# EAGLE design UselessBox (EAGLE 7.2.0)
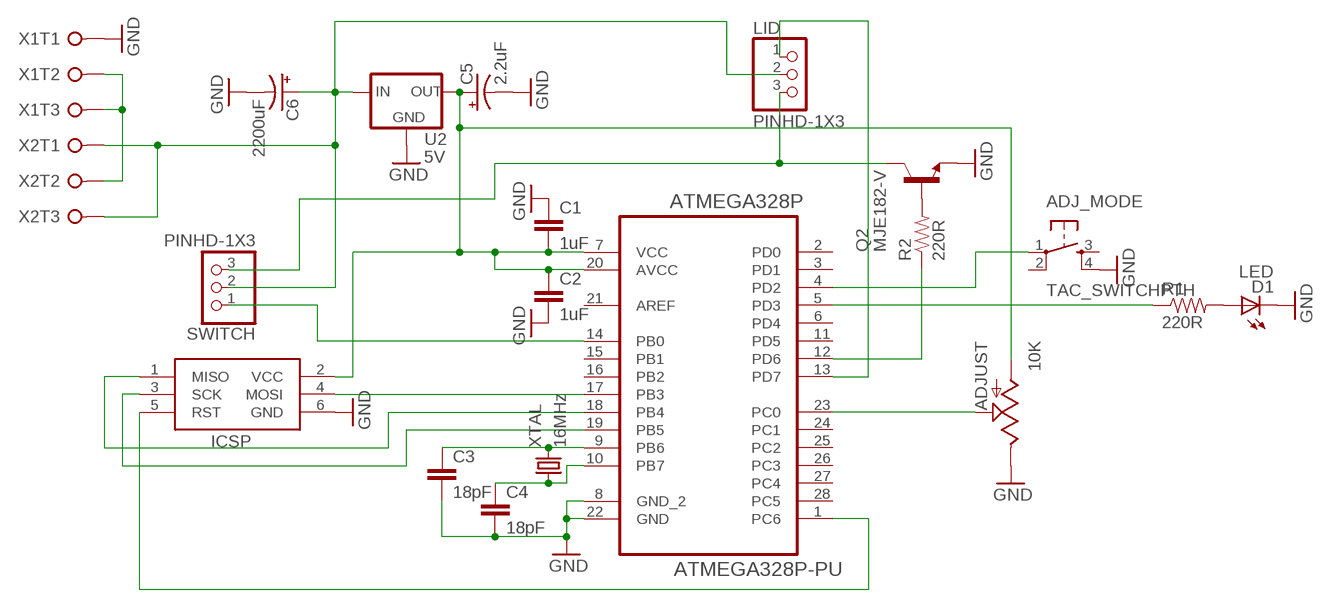
[diagram p0: schematic, sheet 1]

## Parts
ADJ_MODE  TAC_SWITCHPTH  [TACTILE-SWITCH-6MM]
ADJUST  10K  POT100K_3362U  [POT-3362U]
ATMEGA328P  ATMEGA328P-PU  [DIP28]
C1  1uF  CAPACITOR-5MM  [CAPACITOR-5MM]
C2  1uF  CAPACITOR-5MM  [CAPACITOR-5MM]
C3  18pF  CAPACITOR-2.5MM  [CAPACITOR-2.5MM]
C4  18pF  CAPACITOR-2.5MM  [CAPACITOR-2.5MM]
C5  2.2uF  CAP-POL-2.5-5  [CAP-POL-2.5-5]
C6  2200uF  CAP-POL-5-10  [CAP-POL-5-10]
D1  LED  [LED5MM]
ICSP  AVRISP-6  [AVRISP]
LID  PINHD-1X3  [1X03]
Q2  MJE182-V  [TO225AA-V]
R1  220R  RESISTOR-7.5MM  [AXIAL-7.5MM]
R2  220R  RESISTOR-7.5MM  [AXIAL-7.5MM]
SWITCH  PINHD-1X3  [1X03]
U2  5V  LP2950  [TO92-INLINE]
X1  SCREW-TERM-3  [SCREW-TERM-3]
X2  SCREW-TERM-3  [SCREW-TERM-3]
XTAL  16MHz  CRYSTAL-V  [CRYSTAL-V]

## Nets
GND: ADJ_MODE.4 ADJUST.P$1(E) ATMEGA328P.8(GND_2) ATMEGA328P.22(GND) C1.1 C2.2 C3.2 C4.2 C5.- C6.- D1.K(C) ICSP.6(GND) Q2.E U2.2(GND) X1.1
N$1: ATMEGA328P.13(PD7) LID.1
N$2: ADJ_MODE.1 ATMEGA328P.4(PD2)
N$3: ATMEGA328P.19(PB5) ICSP.3(SCK)
N$5: ATMEGA328P.18(PB4) ICSP.1(MISO)
N$6: ATMEGA328P.17(PB3) ICSP.4(MOSI)
N$7: ATMEGA328P.1(PC6) ICSP.5(RST)
N$8: ATMEGA328P.14(PB0) SWITCH.1
N$9: ATMEGA328P.9(PB6) C3.1 XTAL.2
N$10: ATMEGA328P.10(PB7) C4.1 XTAL.1
N$12: ATMEGA328P.12(PD6) R2.P$1
N$13: LID.3 Q2.C SWITCH.3
N$14: X1.2 X1.3 X2.2
N$15: ADJUST.P$2(S) ATMEGA328P.23(PC0)
N$17: Q2.B R2.P$2
N$18: D1.A R1.P$2
N$19: ATMEGA328P.5(PD3) R1.P$1
VCC: ADJUST.P$3(A) ATMEGA328P.7(VCC) ATMEGA328P.20(AVCC) C1.2 C2.1 C5.+ ICSP.2(VCC) U2.1(OUT)
VIN: C6.+ LID.2 SWITCH.2 U2.3(IN) X2.1 X2.3
Unconnected: ADJ_MODE.2 ADJ_MODE.3 ATMEGA328P.2(PD0) ATMEGA328P.3(PD1) ATMEGA328P.6(PD4) ATMEGA328P.11(PD5) ATMEGA328P.15(PB1) ATMEGA328P.16(PB2) ATMEGA328P.21(AREF) ATMEGA328P.24(PC1) ATMEGA328P.25(PC2) ATMEGA328P.26(PC3) ATMEGA328P.27(PC4) ATMEGA328P.28(PC5)

## Library data of the parts
ADJ_MODE = SaintGimp:TAC_SWITCH: Momentary Switch Button commonly used for reset or general input. Spark Fun Electronics SKU : COM-00097 SMT- SWCH-08247
ADJUST = SaintGimp:POT
ATMEGA328P = SaintGimp:ATMEGA328P-PU: 8-bit Microcontroller with In-System Programmable Flash; MPN: ATMEGA328P-PU; OC_FARNELL: 1715487; OC_NEWARK: 15R0268; PACKAGE: PDIP-28; SUPPLIER: Atmel
C1-C4 = SaintGimp:CAPACITOR-*: Ceramic Capacitor
C5 C6 = SaintGimp:CAP-POL: Polarized Capacitor
D1 = SaintGimp:LED
ICSP = SaintGimp:AVRISP: AVR ISP HEADER Standard 6 pin header for AVR programming
LID SWITCH = SaintGimp:PINHD-1X3: PIN HEADER
Q2 = SaintGimp:MJE182: NPN Transistor
R1 R2 = SaintGimp:RESISTOR-*
U2 = SaintGimp:LP2950: Volate Regulator
X1 X2 = SaintGimp:SCREW-TERM-3: 3-Pin Screw Terminal
XTAL = SaintGimp:CRYSTAL: Crystal Oscillator

## Board
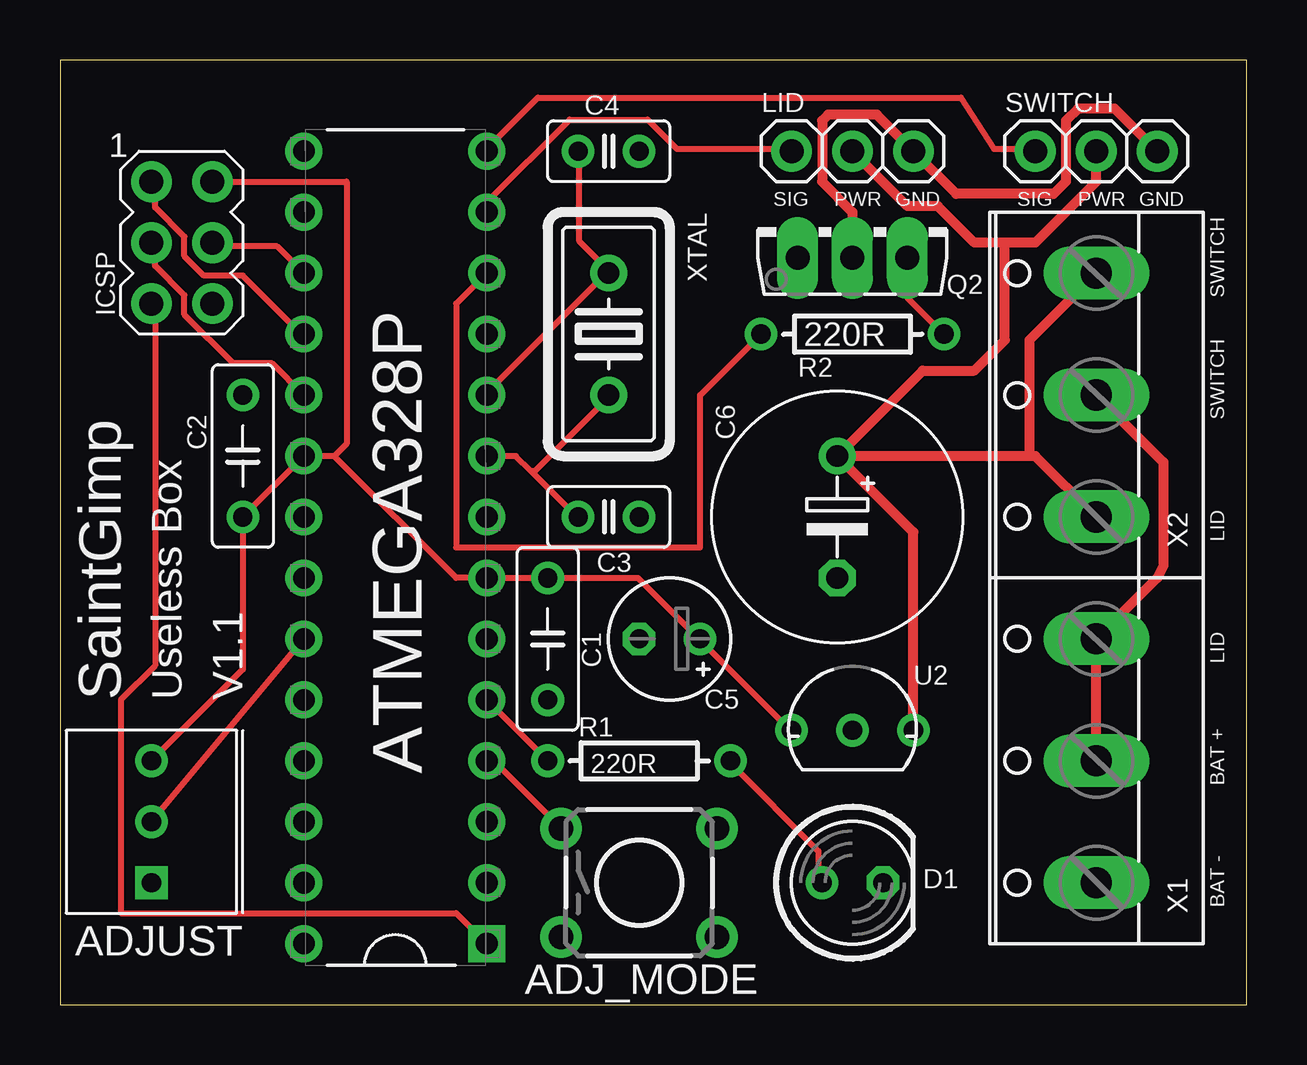
[diagram p1: board, top side]
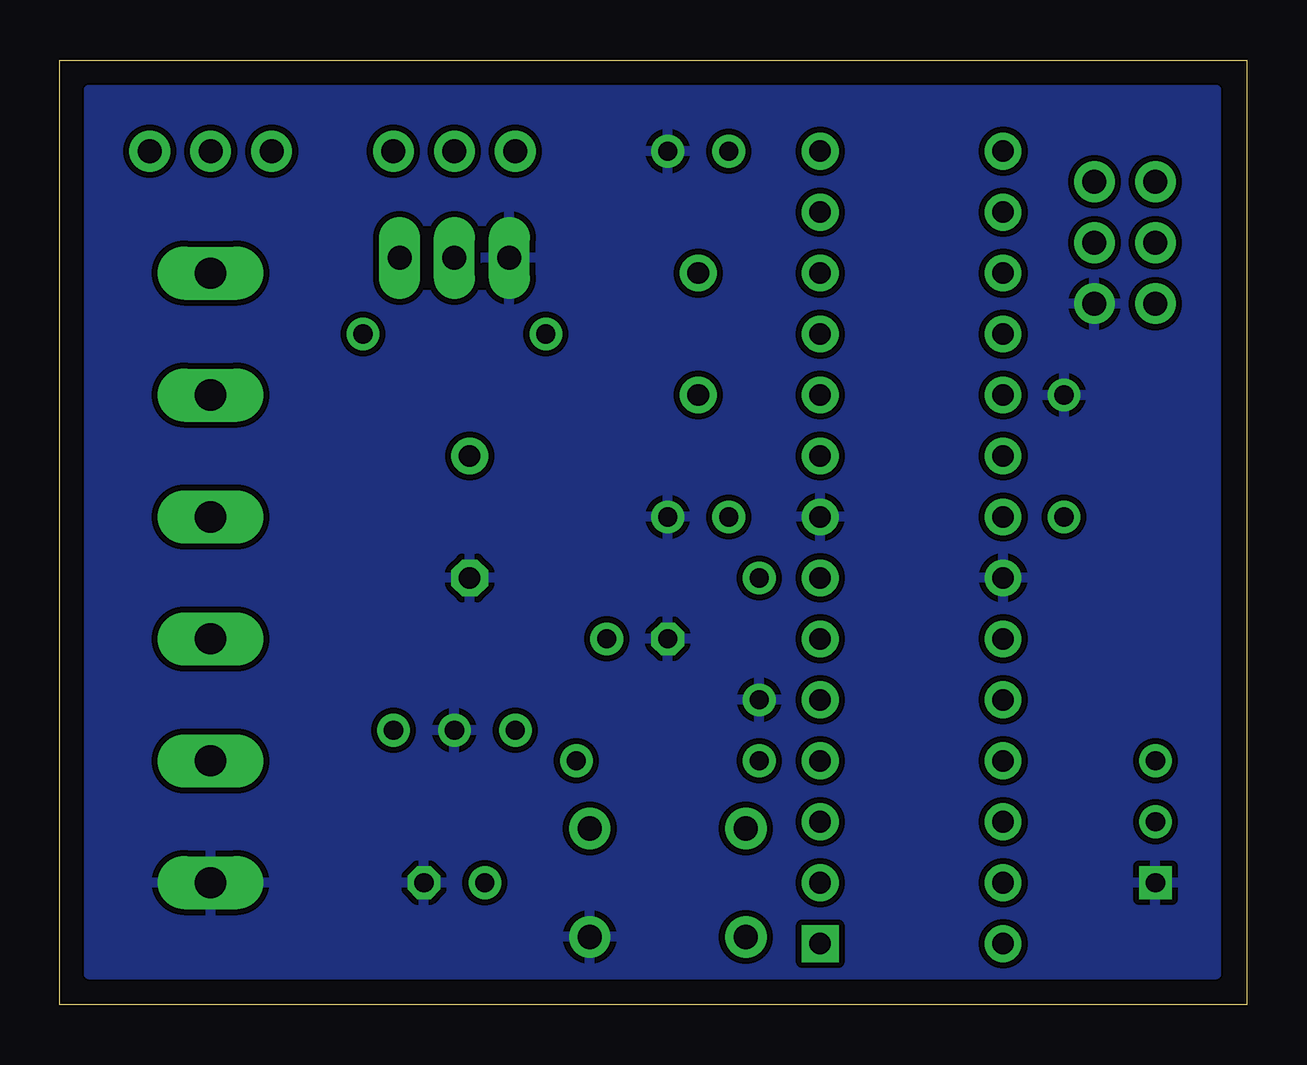
[diagram p2: board, bottom side, seen from below]

Size 49.45 x 39.36 mm. Coordinates in mm from the lower left corner, seen from the top.
Outline: 0,0 49.45,0 49.45,39.36 0,39.36 0,0
Copper layers (1*16): Top 0.0356mm / dielectric 1.5011mm / Bottom 0.0356mm
Design rules "OSHPark": minimum track width 10mil, minimum drill 13mil, track to track 6mil, track to pad 6mil, pad to pad 6mil, via to via 6mil, smd to smd 6mil, copper to edge 15mil, drill to drill 6mil, minimum pad ring 7mil, minimum via ring 7mil, stop-mask expansion 3mil, vias tented up to drill 0mil, thermal gap 10mil

### Footprints (pad centres in the part's own frame; a part is rotated, then mirrored left to right if it is on the bottom)
TACTILE-SWITCH-6MM = drill 1.016: 1 -3.251,2.261; 2 3.251,2.261; 3 -3.251,-2.261; 4 3.251,-2.261
POT-3362U = drill 0.8 square: P$1 0,2.54 | drill 0.8: P$2 2.54,2.54; P$3 5.08,2.54
DIP28 = drill 0.9 square: 1 -7.62,33.02 | drill 0.9: 2 -7.62,30.48; 3 -7.62,27.94; 4 -7.62,25.4; 5 -7.62,22.86; 6 -7.62,20.32; 7 -7.62,17.78; 8 -7.62,15.24; 9 -7.62,12.7; 10 -7.62,10.16; 11 -7.62,7.62; 12 -7.62,5.08; 13 -7.62,2.54; 14 -7.62,0; 15 0,0; 16 0,2.54; 17 0,5.08; 18 0,7.62; 19 0,10.16; 20 0,12.7; 21 0,15.24; 22 0,17.78; 23 0,20.32; 24 0,22.86; 25 0,25.4; 26 0,27.94; 27 0,30.48; 28 0,33.02
CAPACITOR-5MM = drill 0.8: 1 -2.54,0; 2 2.54,0
CAPACITOR-2.5MM = drill 0.8: 1 0,0; 2 2.54,0
CAP-POL-2.5-5 = drill 0.8: + -1.27,0 | drill 0.8 octagon: - 1.27,0
CAP-POL-5-10 = drill 0.9: + -2.54,0 | drill 0.9 octagon: - 2.54,0
LED5MM = drill 0.8: A -1.27,0 | drill 0.8 octagon: K 1.27,0
AVRISP = drill 1: 1 -1.27,2.54; 2 1.27,2.54; 3 -1.27,0; 4 1.27,0; 5 -1.27,-2.54; 6 1.27,-2.54
1X03 = drill 1: 1 -2.54,0; 2 0,0; 3 2.54,0
TO225AA-V = drill 1 long: B 2.286,-1.27; C 0,-1.27; E -2.286,-1.27
AXIAL-7.5MM = drill 0.8: P$1 -3.81,0; P$2 3.81,0
TO92-INLINE = drill 0.8: 1 -2.54,0; 2 0,0; 3 2.54,0
SCREW-TERM-3 = drill 1.3 long: 1 -5.08,0; 2 0,0; 3 5.08,0
CRYSTAL-V = drill 0.9: 1 -2.54,0; 2 2.54,0

### Placement (x,y rotation side)
ADJ_MODE  24.13,5.08 0 top
ADJUST  6.35,5.08 90 top
ATMEGA328P  10.16,35.56 180 top
C1  20.32,15.24 90 top
C2  7.62,22.86 90 top
C3  21.59,20.32 0 top
C4  21.59,35.56 0 top
C5  25.4,15.24 180 top
C6  32.39,20.32 270 top
D1  33.02,5.08 0 top
ICSP  5.08,31.75 0 top
LID  33.02,35.56 0 top
Q2  33.02,32.38 0 top
R1  24.13,10.16 0 top
R2  33.02,27.94 0 top
SWITCH  43.18,35.56 0 top
U2  33.02,11.43 0 top
X1  43.18,10.16 90 top
X2  43.18,25.4 90 top
XTAL  22.86,27.94 270 top

### Tracks (layer width: path | path; a pad name or v marks a point on that pad's centre or on a via)
GND
  pour Bottom (isolate 0.254): 1.27,38.1 48.26,38.1 48.26,1.27 1.27,1.27
N$1
  Top 0.254: ATMEGA328P.13 17.78,33.43 21.23,36.88 24.49,36.88 25.71,35.66 30.38,35.66 LID.1
N$2
  Top 0.254: ATMEGA328P.4 17.78,10.06 18.19,10.06 20.83,7.42 ADJ_MODE.1
N$3
  Top 0.254: ATMEGA328P.19 8.84,26.72 7.21,26.72 5.18,28.75 5.18,29.57 3.96,30.78 3.96,31.6 ICSP.3
N$5
  Top 0.254: ICSP.1 3.96,34.24 3.96,33.22 5.18,32 5.18,31.19 5.99,30.38 7.62,30.38 10.06,27.94 ATMEGA328P.18
N$6
  Top 0.254: ATMEGA328P.17 9.04,31.6 6.4,31.6 ICSP.4
N$7
  Top 0.254: ICSP.5 3.96,29.16 3.96,14.12 2.54,12.7 2.54,3.81 16.51,3.81 ATMEGA328P.1
N$8
  Top 0.254: SWITCH.1 40.54,35.66 38.91,35.66 37.54,37.8 19.91,37.8 17.78,35.66 ATMEGA328P.14
N$9
  Top 0.254: ATMEGA328P.9 19,22.86 19.61,22.25 | 19.61,22.25 21.44,20.42 C3.1 | 19.61,22.25 19.81,22.25 22.86,25.3 XTAL.2
N$10
  Top 0.254: 22.86,30.58 17.78,25.5 ATMEGA328P.10 | 22.86,30.58 21.64,31.8 21.64,35.46 C4.1 | 22.86,30.58 XTAL.1
N$12
  Top 0.254: ATMEGA328P.12 16.51,29.21 16.51,19.05 26.67,19.05 26.67,25.4 R2.P$1
N$13
  Top 0.406: SWITCH.3 43.94,37.34 42.42,37.34 41.91,36.83 41.91,34.29 41.4,33.78 37.34,33.78 LID.3 34.04,37.08 32,37.08 31.75,36.83 31.75,34.29 33.02,33.02 Q2.C
N$14
  Top 0.406: X1.2 X1.3 45.72,17.78 45.97,18.29 45.97,22.61 X2.2
N$15
  Top 0.254: ADJUST.P$2 ATMEGA328P.23
N$17
  Top 0.254: R2.P$2 35.31,29.46 Q2.B
N$18
  Top 0.254: D1.A 31.6,5.18 31.6,6.4 27.94,10.06 R1.P$2
N$19
  Top 0.254: R1.P$1 ATMEGA328P.5
VCC
  Top 0.254: U2.1 30.38,11.48 26.72,15.14 C5.+ 26.52,15.34 24.08,17.78 C1.2 ATMEGA328P.7 16.51,17.78 11.43,22.86 | ADJUST.P$3 7.62,13.97 C2.1 ATMEGA328P.20 11.43,22.86 | ICSP.2 11.94,34.29 11.94,23.37 11.43,22.86
VIN
  Top 0.254: 43.18,35.66 SWITCH.2 | 43.18,30.58 X2.3
  Top 0.406: SWITCH.2 43.18,34.29 40.64,31.75 39.37,31.75 | 39.37,31.75 38.1,31.75 36.58,33.27 35.31,33.27 LID.2 | X2.3 40.39,27.69 40.39,22.86 | C6.+ 35.94,26.42 38.1,26.42 39.37,27.69 39.37,31.75 | X2.1 40.64,22.86 40.39,22.86 | 40.39,22.86 C6.+ | U2.3 35.56,19.69 C6.+

### Text on the board
_tsilk: SIG | PWR | GND | SIG | PWR | GND | SWITCH | SWITCH | LID | LID | SaintGimp | Useless Box | V1.1 | BAT + | BAT -